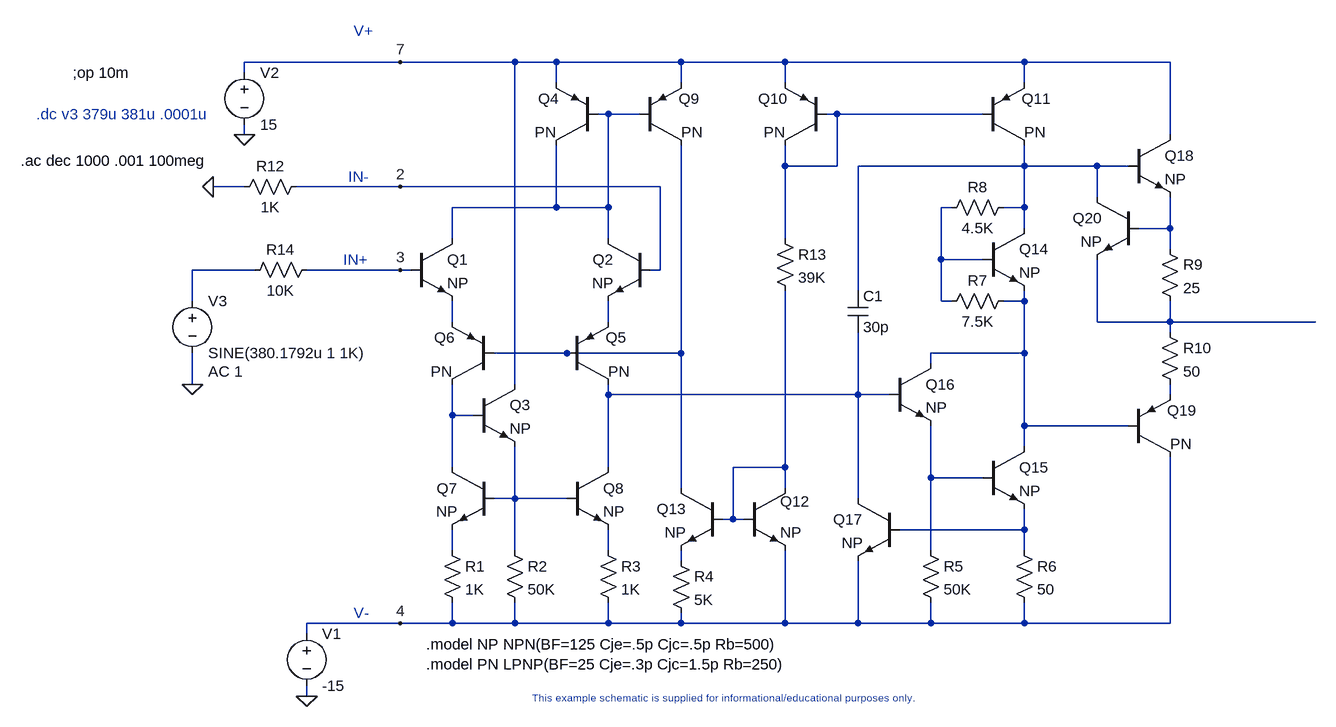
[diagram p0: schematic LM741_1.asc]
LM741_1.asc, the LTspice schematic file:
Version 4
SHEET 1 3268 1552
WIRE 1856 464 1616 464
WIRE 2032 464 1856 464
WIRE 2096 464 2032 464
WIRE 2288 464 2096 464
WIRE 2448 464 2288 464
WIRE 2816 464 2448 464
WIRE 3040 464 2816 464
WIRE 1616 480 1616 464
WIRE 2096 496 2096 464
WIRE 2288 496 2288 464
WIRE 2448 496 2448 464
WIRE 2816 496 2816 464
WIRE 2176 544 2160 544
WIRE 2224 544 2176 544
WIRE 2528 544 2512 544
WIRE 2752 544 2528 544
WIRE 1616 576 1616 560
WIRE 3040 576 3040 464
WIRE 2448 624 2448 592
WIRE 2528 624 2528 544
WIRE 2528 624 2448 624
WIRE 2816 624 2816 592
WIRE 2816 624 2560 624
WIRE 2928 624 2816 624
WIRE 2976 624 2928 624
WIRE 1616 656 1568 656
WIRE 1856 656 1696 656
WIRE 2256 656 1856 656
WIRE 2928 672 2928 624
WIRE 2096 688 2096 592
WIRE 2096 688 1936 688
WIRE 2176 688 2176 544
WIRE 2176 688 2096 688
WIRE 2704 688 2688 688
WIRE 2816 688 2816 624
WIRE 2816 688 2784 688
WIRE 2816 720 2816 688
WIRE 3040 720 3040 672
WIRE 3040 720 2992 720
WIRE 1936 736 1936 688
WIRE 2176 736 2176 688
WIRE 2448 736 2448 624
WIRE 3040 752 3040 720
WIRE 2688 768 2688 688
WIRE 2752 768 2688 768
WIRE 1632 784 1536 784
WIRE 1856 784 1712 784
WIRE 1872 784 1856 784
WIRE 2256 784 2256 656
WIRE 2256 784 2240 784
WIRE 2560 816 2560 624
WIRE 1536 832 1536 784
WIRE 2688 832 2688 768
WIRE 2704 832 2688 832
WIRE 2816 832 2816 816
WIRE 2816 832 2784 832
WIRE 1936 864 1936 832
WIRE 2176 864 2176 832
WIRE 2928 864 2928 768
WIRE 3040 864 3040 832
WIRE 3040 864 2928 864
WIRE 3264 864 3040 864
WIRE 3040 880 3040 864
WIRE 2112 912 2000 912
WIRE 2288 912 2288 592
WIRE 2288 912 2112 912
WIRE 2816 912 2816 832
WIRE 2816 912 2672 912
WIRE 2672 928 2672 912
WIRE 1536 960 1536 912
WIRE 2032 960 2032 464
WIRE 2176 976 2176 960
WIRE 2560 976 2560 880
WIRE 2560 976 2176 976
WIRE 2608 976 2560 976
WIRE 3040 976 3040 960
WIRE 1936 1008 1936 960
WIRE 1968 1008 1936 1008
WIRE 2816 1024 2816 912
WIRE 2976 1024 2816 1024
WIRE 2816 1056 2816 1024
WIRE 1936 1088 1936 1008
WIRE 2176 1088 2176 976
WIRE 2448 1088 2448 816
WIRE 2448 1088 2368 1088
WIRE 2672 1104 2672 1024
WIRE 2752 1104 2672 1104
WIRE 2288 1120 2288 912
WIRE 2448 1120 2448 1088
WIRE 2032 1136 2032 1056
WIRE 2032 1136 2000 1136
WIRE 2112 1136 2032 1136
WIRE 2560 1136 2560 976
WIRE 2368 1168 2368 1088
WIRE 2368 1168 2352 1168
WIRE 2384 1168 2368 1168
WIRE 2816 1184 2816 1152
WIRE 2816 1184 2624 1184
WIRE 1936 1216 1936 1184
WIRE 2032 1216 2032 1136
WIRE 2176 1216 2176 1184
WIRE 2672 1216 2672 1104
WIRE 2816 1216 2816 1184
WIRE 2288 1232 2288 1216
WIRE 1856 1328 1712 1328
WIRE 1936 1328 1936 1296
WIRE 1936 1328 1856 1328
WIRE 2032 1328 2032 1296
WIRE 2032 1328 1936 1328
WIRE 2176 1328 2176 1296
WIRE 2176 1328 2032 1328
WIRE 2288 1328 2288 1312
WIRE 2288 1328 2176 1328
WIRE 2448 1328 2448 1216
WIRE 2448 1328 2288 1328
WIRE 2560 1328 2560 1232
WIRE 2560 1328 2448 1328
WIRE 2672 1328 2672 1296
WIRE 2672 1328 2560 1328
WIRE 2816 1328 2816 1296
WIRE 2816 1328 2672 1328
WIRE 3040 1328 3040 1072
WIRE 3040 1328 2816 1328
WIRE 1712 1344 1712 1328
WIRE 1712 1440 1712 1424
FLAG 1856 784 3
FLAG 1856 656 2
FLAG 1712 1440 0
FLAG 1616 576 0
FLAG 1568 656 0
FLAG 1536 960 0
FLAG 1856 464 7
FLAG 1856 1328 4
DATAFLAG 3136 864 ""
DATAFLAG 2816 896 ""
DATAFLAG 2848 624 ""
DATAFLAG 2560 976 ""
SYMBOL NPN 1872 736 R0
SYMATTR InstName Q1
SYMATTR Value NP
SYMBOL npn 2240 736 M0
SYMATTR InstName Q2
SYMATTR Value NP
SYMBOL PNP 2112 960 M180
WINDOW 0 60 72 Left 2
WINDOW 3 64 20 Left 2
SYMATTR InstName Q5
SYMATTR Value PN
SYMBOL pnp 2000 960 R180
WINDOW 0 60 72 Left 2
WINDOW 3 64 20 Left 2
SYMATTR InstName Q6
SYMATTR Value PN
SYMBOL npn 2000 1088 M0
SYMATTR InstName Q7
SYMATTR Value NP
SYMBOL npn 2112 1088 R0
SYMATTR InstName Q8
SYMATTR Value NP
SYMBOL npn 1968 960 R0
SYMATTR InstName Q3
SYMATTR Value NP
SYMBOL pnp 2160 592 R180
WINDOW 0 60 72 Left 2
WINDOW 3 64 20 Left 2
SYMATTR InstName Q4
SYMATTR Value PN
SYMBOL RES 1920 1200 R0
SYMATTR InstName R1
SYMATTR Value 1K
SYMBOL res 2016 1200 R0
SYMATTR InstName R2
SYMATTR Value 50K
SYMBOL res 2160 1200 R0
SYMATTR InstName R3
SYMATTR Value 1K
SYMBOL pnp 2224 592 M180
WINDOW 0 60 72 Left 2
WINDOW 3 64 20 Left 2
SYMATTR InstName Q9
SYMATTR Value PN
SYMBOL pnp 2512 592 R180
WINDOW 0 60 72 Left 2
WINDOW 3 64 20 Left 2
SYMATTR InstName Q10
SYMATTR Value PN
SYMBOL pnp 2752 592 M180
WINDOW 0 60 72 Left 2
WINDOW 3 64 20 Left 2
SYMATTR InstName Q11
SYMATTR Value PN
SYMBOL npn 2384 1120 R0
WINDOW 0 56 20 Left 2
SYMATTR InstName Q12
SYMATTR Value NP
SYMBOL npn 2352 1120 M0
SYMATTR InstName Q13
SYMATTR Value NP
SYMBOL res 2272 1216 R0
SYMATTR InstName R4
SYMATTR Value 5K
SYMBOL npn 2752 720 R0
SYMATTR InstName Q14
SYMATTR Value NP
SYMBOL npn 2752 1056 R0
SYMATTR InstName Q15
SYMATTR Value NP
SYMBOL npn 2608 928 R0
SYMATTR InstName Q16
SYMATTR Value NP
SYMBOL res 2656 1200 R0
SYMATTR InstName R5
SYMATTR Value 50K
SYMBOL res 2800 1200 R0
SYMATTR InstName R6
SYMATTR Value 50
SYMBOL npn 2624 1136 M0
SYMATTR InstName Q17
SYMATTR Value NP
SYMBOL cap 2544 816 R0
SYMATTR InstName C1
SYMATTR Value 30p
SYMBOL res 2800 816 R90
WINDOW 0 0 56 VBottom 2
WINDOW 3 32 56 VTop 2
SYMATTR InstName R7
SYMATTR Value 7.5K
SYMBOL res 2800 672 R90
WINDOW 0 0 56 VBottom 2
WINDOW 3 32 56 VTop 2
SYMATTR InstName R8
SYMATTR Value 4.5K
SYMBOL npn 2976 576 R0
SYMATTR InstName Q18
SYMATTR Value NP
SYMBOL pnp 2976 1072 M180
WINDOW 0 60 72 Left 2
WINDOW 3 64 20 Left 2
SYMATTR InstName Q19
SYMATTR Value PN
SYMBOL res 3024 736 R0
SYMATTR InstName R9
SYMATTR Value 25
SYMBOL res 3024 864 R0
SYMATTR InstName R10
SYMATTR Value 50
SYMBOL npn 2992 672 M0
SYMATTR InstName Q20
SYMATTR Value NP
SYMBOL VOLTAGE 1712 1328 R0
SYMATTR InstName V1
SYMATTR Value -15
SYMBOL voltage 1616 464 R0
SYMATTR InstName V2
SYMATTR Value 15
SYMBOL res 1712 640 R90
WINDOW 0 0 56 VBottom 2
WINDOW 3 32 56 VTop 2
SYMATTR InstName R12
SYMATTR Value 1K
SYMBOL voltage 1536 816 R0
WINDOW 123 24 124 Left 2
WINDOW 39 0 0 Left 0
SYMATTR InstName V3
SYMATTR Value SINE(380.1792u 1 1K)
SYMATTR Value2 AC 1
SYMBOL res 2432 720 R0
SYMATTR InstName R13
SYMATTR Value 39K
SYMBOL res 1728 768 R90
WINDOW 0 0 56 VBottom 2
WINDOW 3 32 56 VTop 2
SYMATTR InstName R14
SYMATTR Value 10K
TEXT 1768 768 Left 2 ;IN+
TEXT 1776 640 Left 2 ;IN-
TEXT 2344 1432 Top 1 ;This example schematic is supplied for informational/educational purposes only.
TEXT 1784 1312 Left 2 ;V-
TEXT 1784 416 Left 2 ;V+
TEXT 1896 1360 Left 2 !.model NP NPN(BF=125 Cje=.5p Cjc=.5p Rb=500)\n.model PN LPNP(BF=25 Cje=.3p Cjc=1.5p Rb=250)
TEXT 1352 480 Left 2 !;op 10m
TEXT 1296 544 Left 2 ;.dc v3 379u 381u .0001u
TEXT 1272 616 Left 2 !.ac dec 1000 .001 100meg

The netlist it stands for:
* LM741_1.asc
Q1 N001 3 N008 0 NP
Q2 N001 2 N009 0 NP
Q5 N012 N011 N009 0 PN
Q6 N014 N011 N008 0 PN
Q7 N014 N017 N019 0 NP
Q8 N012 N017 N020 0 NP
Q3 7 N014 N017 0 NP
Q4 N001 N001 7 0 PN
R1 N019 4 1K
R2 N017 4 50K
R3 N020 4 1K
Q9 N011 N001 7 0 PN
Q10 N002 N002 7 0 PN
Q11 N003 N002 7 0 PN
Q12 N015 N015 4 0 NP
Q13 N011 N015 N021 0 NP
R4 N021 4 5K
Q14 N003 N004 N007 0 NP
Q15 N007 N016 N018 0 NP
Q16 N007 N012 N016 0 NP
R5 N016 4 50K
R6 N018 4 50
Q17 N012 N018 4 0 NP
C1 N003 N012 30p
R7 N007 N004 7.5K
R8 N003 N004 4.5K
Q18 7 N003 N005 0 NP
Q19 4 N007 N013 0 PN
R9 N005 N010 25
R10 N010 N013 50
Q20 N003 N005 N010 0 NP
V1 4 0 -15
V2 7 0 15
R12 2 0 1K
V3 N006 0 SINE(380.1792u 1 1K) AC 1
R13 N002 N015 39K
R14 3 N006 10K
.model NPN NPN
.model PNP PNP
.lib standard.bjt
* IN+
* IN-
* This example schematic is supplied for informational/educational purposes only.
* V-
* V+
.model NP NPN(BF=125 Cje=.5p Cjc=.5p Rb=500)
.model PN LPNP(BF=25 Cje=.3p Cjc=1.5p Rb=250)
;op 10m
* .dc v3 379u 381u .0001u
.ac dec 1000 .001 100meg
.backanno
.end